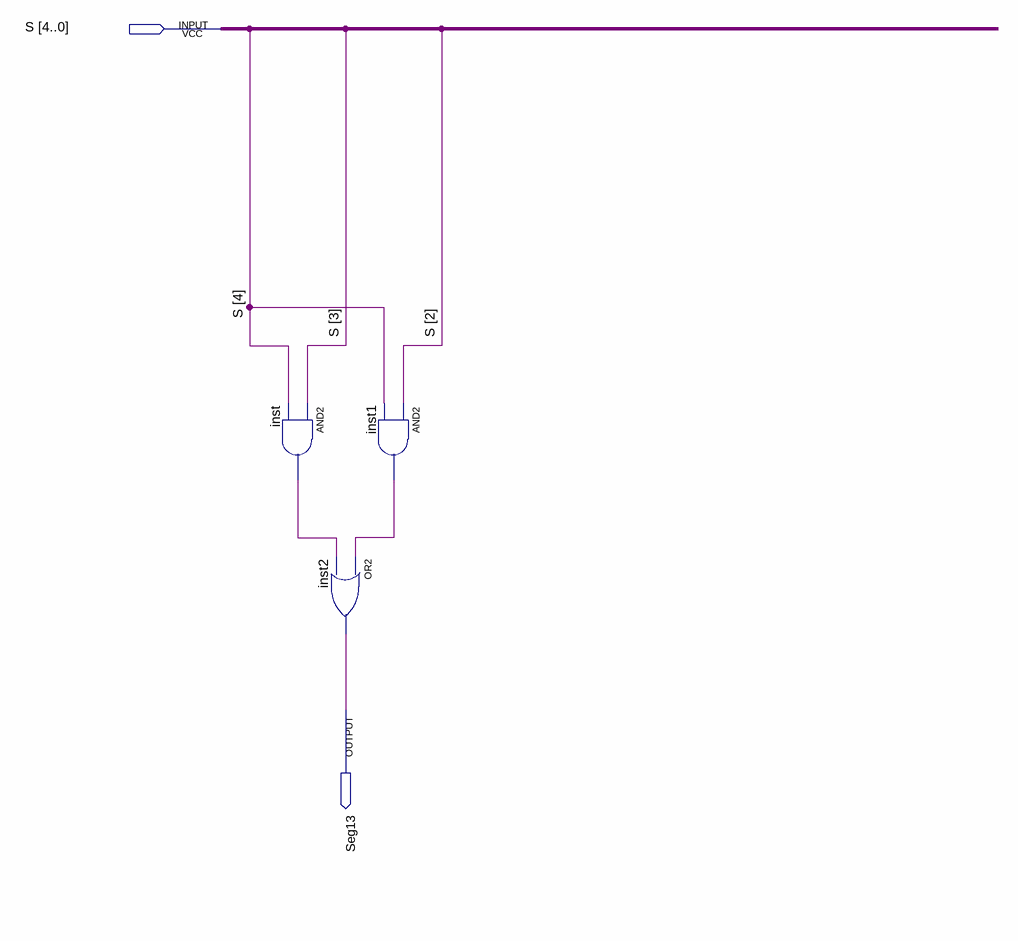
[diagram p0: schematic sheet]
// Quartus schematic Seg13.bdf as structural Verilog: 3 symbols, 2 pins
module Seg13 (
  input  [4:0] S,
  output Seg13
);

  wire inst1_out, inst_out;

  and inst (inst_out, S[3], S[4]);
  or inst2 (Seg13, inst1_out, inst_out);
  and inst1 (inst1_out, S[2], S[4]);
endmodule
